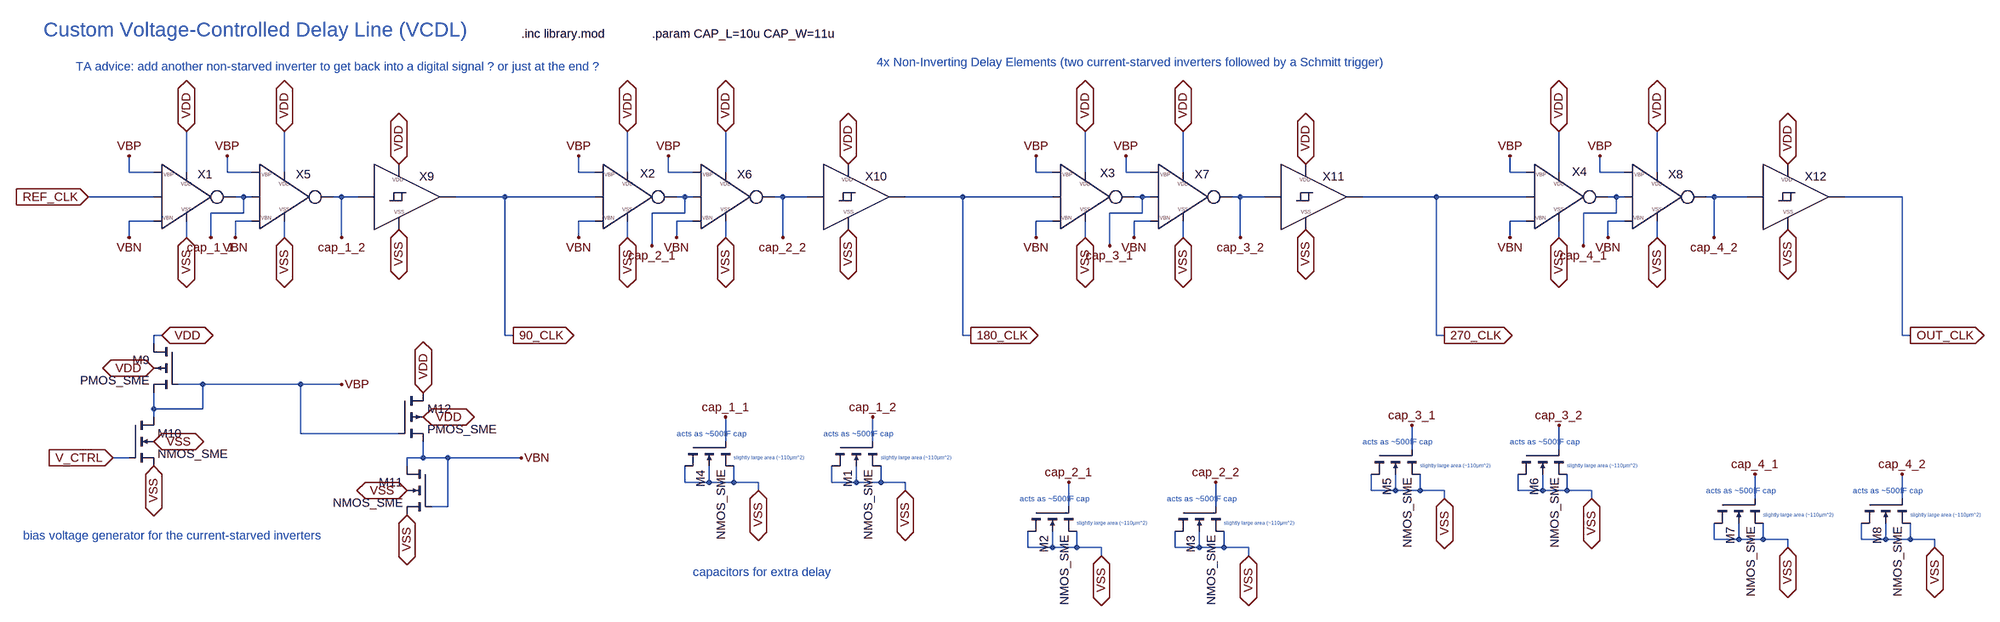
[diagram p0: schematic my_vcdl.asc]
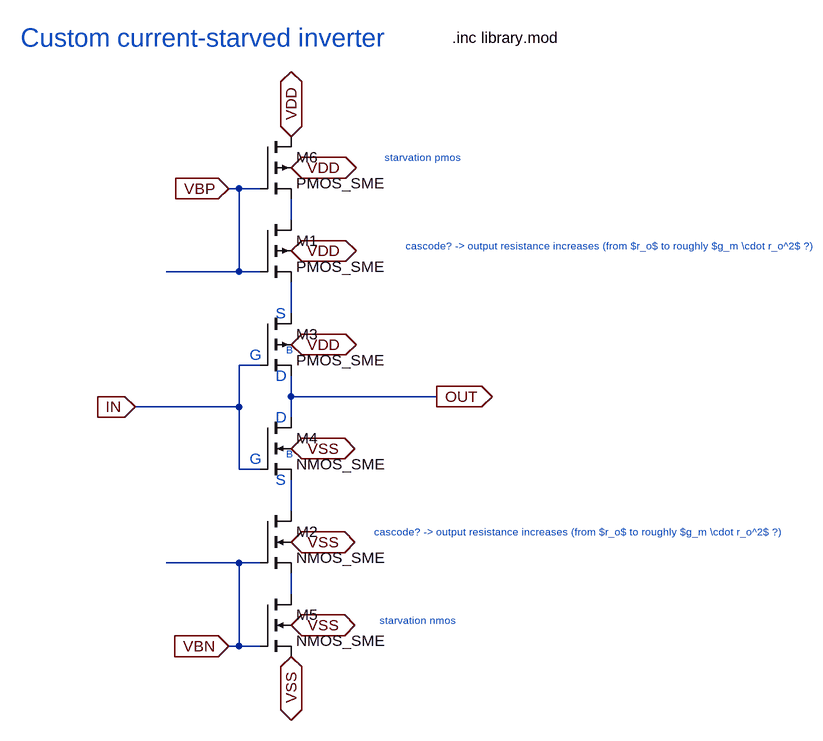
[diagram p1: sub-circuit my_current_starved_inverter.asc]
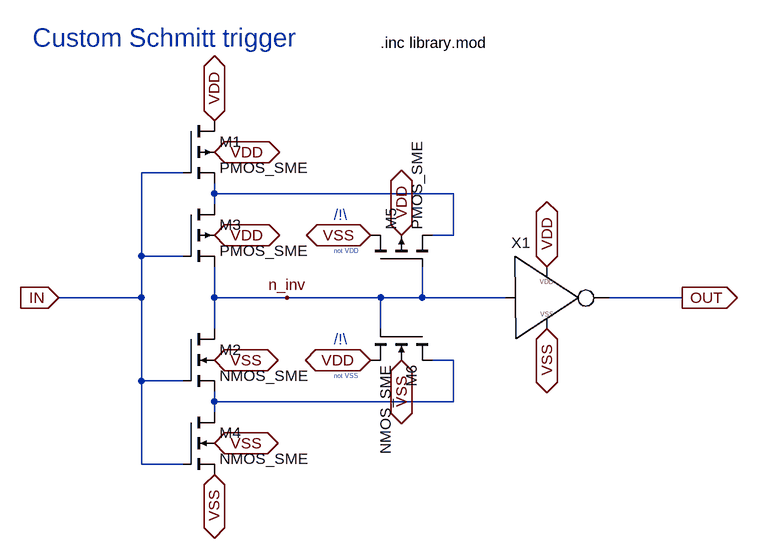
[diagram p2: sub-circuit my_schmitt_trigger.asc]
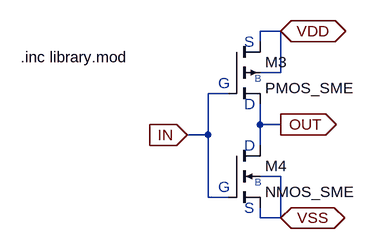
[diagram p3: sub-circuit my_inverter.asc]
my_vcdl.asc, the LTspice schematic file:
Version 4.1
SHEET 1 3608 1576
WIRE -48 160 -48 128
WIRE 0 160 -48 160
WIRE 64 160 64 80
WIRE 144 160 144 128
WIRE 192 160 144 160
WIRE 256 160 256 80
WIRE 832 160 832 128
WIRE 864 160 832 160
WIRE 928 160 928 80
WIRE 1008 160 1008 128
WIRE 1056 160 1008 160
WIRE 1120 160 1120 80
WIRE 1728 160 1728 128
WIRE 1760 160 1728 160
WIRE 1824 160 1824 80
WIRE 1904 160 1904 128
WIRE 1952 160 1904 160
WIRE 2016 160 2016 80
WIRE 2656 160 2656 128
WIRE 2688 160 2656 160
WIRE 2752 160 2752 80
WIRE 2832 160 2832 128
WIRE 2880 160 2832 160
WIRE 2944 160 2944 80
WIRE 0 208 -128 208
WIRE 176 208 160 208
WIRE 192 208 176 208
WIRE 368 208 352 208
WIRE 400 208 368 208
WIRE 688 208 592 208
WIRE 864 208 688 208
WIRE 1040 208 1024 208
WIRE 1056 208 1040 208
WIRE 1232 208 1216 208
WIRE 1280 208 1232 208
WIRE 1584 208 1472 208
WIRE 1760 208 1584 208
WIRE 1936 208 1920 208
WIRE 1952 208 1936 208
WIRE 2128 208 2112 208
WIRE 2176 208 2128 208
WIRE 2512 208 2368 208
WIRE 2688 208 2512 208
WIRE 2864 208 2848 208
WIRE 2880 208 2864 208
WIRE 3056 208 3040 208
WIRE 3120 208 3056 208
WIRE 3424 208 3312 208
WIRE 176 240 176 208
WIRE 176 240 112 240
WIRE 1040 240 1040 208
WIRE 1040 240 976 240
WIRE 1936 240 1936 208
WIRE 1936 240 1872 240
WIRE 2864 240 2864 208
WIRE 2864 240 2800 240
WIRE 0 256 -48 256
WIRE 192 256 160 256
WIRE 864 256 832 256
WIRE 1056 256 1024 256
WIRE 1760 256 1728 256
WIRE 1952 256 1920 256
WIRE 2688 256 2656 256
WIRE 2880 256 2848 256
WIRE -48 288 -48 256
WIRE 64 288 64 256
WIRE 112 288 112 240
WIRE 160 288 160 256
WIRE 256 288 256 256
WIRE 368 288 368 208
WIRE 832 288 832 256
WIRE 928 288 928 256
WIRE 1024 288 1024 256
WIRE 1120 288 1120 256
WIRE 1232 288 1232 208
WIRE 1728 288 1728 256
WIRE 1824 288 1824 256
WIRE 1920 288 1920 256
WIRE 2016 288 2016 256
WIRE 2128 288 2128 208
WIRE 2656 288 2656 256
WIRE 2752 288 2752 256
WIRE 2848 288 2848 256
WIRE 2944 288 2944 256
WIRE 3056 288 3056 208
WIRE 976 304 976 240
WIRE 1872 304 1872 240
WIRE 2800 304 2800 240
WIRE 16 480 0 480
WIRE 688 480 688 208
WIRE 704 480 688 480
WIRE 1584 480 1584 208
WIRE 1600 480 1584 480
WIRE 2512 480 2512 208
WIRE 2528 480 2512 480
WIRE 3424 480 3424 208
WIRE 3440 480 3424 480
WIRE 0 496 0 480
WIRE 96 576 48 576
WIRE 288 576 96 576
WIRE 368 576 288 576
WIRE 0 624 0 592
WIRE 96 624 96 576
WIRE 96 624 0 624
WIRE 0 640 0 624
WIRE 288 672 288 576
WIRE 480 672 288 672
WIRE 1120 688 1120 640
WIRE 1408 688 1408 640
WIRE 2464 704 2464 656
WIRE 2752 704 2752 656
WIRE -48 720 -80 720
WIRE 528 720 528 688
WIRE 528 720 496 720
WIRE 576 720 528 720
WIRE 720 720 576 720
WIRE 496 736 496 720
WIRE 1040 768 1040 736
WIRE 1088 768 1088 736
WIRE 1088 768 1040 768
WIRE 1136 768 1136 736
WIRE 1136 768 1088 768
WIRE 1184 768 1136 768
WIRE 1328 768 1328 736
WIRE 1376 768 1376 736
WIRE 1376 768 1328 768
WIRE 1424 768 1424 736
WIRE 1424 768 1376 768
WIRE 1472 768 1424 768
WIRE 1184 784 1184 768
WIRE 1472 784 1472 768
WIRE 2384 784 2384 752
WIRE 2432 784 2432 752
WIRE 2432 784 2384 784
WIRE 2480 784 2480 752
WIRE 2480 784 2432 784
WIRE 2528 784 2480 784
WIRE 2672 784 2672 752
WIRE 2720 784 2720 752
WIRE 2720 784 2672 784
WIRE 2768 784 2768 752
WIRE 2768 784 2720 784
WIRE 2816 784 2768 784
WIRE 2528 800 2528 784
WIRE 2816 800 2816 784
WIRE 3136 800 3136 752
WIRE 3424 800 3424 752
WIRE 576 816 576 720
WIRE 576 816 544 816
WIRE 1792 816 1792 768
WIRE 2080 816 2080 768
WIRE 3056 880 3056 848
WIRE 3104 880 3104 848
WIRE 3104 880 3056 880
WIRE 3152 880 3152 848
WIRE 3152 880 3104 880
WIRE 3200 880 3152 880
WIRE 3344 880 3344 848
WIRE 3392 880 3392 848
WIRE 3392 880 3344 880
WIRE 3440 880 3440 848
WIRE 3440 880 3392 880
WIRE 3488 880 3440 880
WIRE 1712 896 1712 864
WIRE 1760 896 1760 864
WIRE 1760 896 1712 896
WIRE 1808 896 1808 864
WIRE 1808 896 1760 896
WIRE 1856 896 1808 896
WIRE 2000 896 2000 864
WIRE 2048 896 2048 864
WIRE 2048 896 2000 896
WIRE 2096 896 2096 864
WIRE 2096 896 2048 896
WIRE 2144 896 2096 896
WIRE 3200 896 3200 880
WIRE 3488 896 3488 880
WIRE 1856 912 1856 896
WIRE 2144 912 2144 896
FLAG -128 208 REF_CLK
IOPIN -128 208 In
FLAG -80 720 V_CTRL
IOPIN -80 720 In
FLAG 3440 480 OUT_CLK
IOPIN 3440 480 Out
FLAG 1600 480 180_CLK
IOPIN 1600 480 Out
FLAG 704 480 90_CLK
IOPIN 704 480 Out
FLAG 2528 480 270_CLK
IOPIN 2528 480 Out
FLAG 16 480 VDD
IOPIN 16 480 BiDir
FLAG 0 736 VSS
IOPIN 0 736 BiDir
FLAG 0 688 VSS
IOPIN 0 688 BiDir
FLAG 0 544 VDD
IOPIN 0 544 BiDir
FLAG 64 288 VSS
IOPIN 64 288 BiDir
FLAG 928 288 VSS
IOPIN 928 288 BiDir
FLAG 1824 288 VSS
IOPIN 1824 288 BiDir
FLAG 2752 288 VSS
IOPIN 2752 288 BiDir
FLAG 2752 80 VDD
IOPIN 2752 80 BiDir
FLAG 1824 80 VDD
IOPIN 1824 80 BiDir
FLAG 928 80 VDD
IOPIN 928 80 BiDir
FLAG 64 80 VDD
IOPIN 64 80 BiDir
FLAG 256 288 VSS
IOPIN 256 288 BiDir
FLAG 1120 288 VSS
IOPIN 1120 288 BiDir
FLAG 2016 288 VSS
IOPIN 2016 288 BiDir
FLAG 2944 288 VSS
IOPIN 2944 288 BiDir
FLAG 2944 80 VDD
IOPIN 2944 80 BiDir
FLAG 2016 80 VDD
IOPIN 2016 80 BiDir
FLAG 1120 80 VDD
IOPIN 1120 80 BiDir
FLAG 256 80 VDD
IOPIN 256 80 BiDir
FLAG 368 576 VBP
FLAG 720 720 VBN
FLAG 1008 128 VBP
FLAG 1024 288 VBN
FLAG 832 128 VBP
FLAG 144 128 VBP
FLAG -48 128 VBP
FLAG 1728 128 VBP
FLAG 1904 128 VBP
FLAG 2656 128 VBP
FLAG 2832 128 VBP
FLAG 1728 288 VBN
FLAG 1920 288 VBN
FLAG 2656 288 VBN
FLAG 2848 288 VBN
FLAG 832 288 VBN
FLAG 160 288 VBN
FLAG -48 288 VBN
FLAG 480 144 VDD
IOPIN 480 144 BiDir
FLAG 480 272 VSS
IOPIN 480 272 BiDir
FLAG 1360 144 VDD
IOPIN 1360 144 BiDir
FLAG 1360 272 VSS
IOPIN 1360 272 BiDir
FLAG 2256 144 VDD
IOPIN 2256 144 BiDir
FLAG 2256 272 VSS
IOPIN 2256 272 BiDir
FLAG 3200 144 VDD
IOPIN 3200 144 BiDir
FLAG 3200 272 VSS
IOPIN 3200 272 BiDir
FLAG 496 784 VSS
IOPIN 496 784 BiDir
FLAG 528 640 VDD
IOPIN 528 640 BiDir
FLAG 528 592 VDD
IOPIN 528 592 BiDir
FLAG 496 832 VSS
IOPIN 496 832 BiDir
FLAG 1184 784 VSS
IOPIN 1184 784 BiDir
FLAG 1120 640 cap_1_1
FLAG 1472 784 VSS
IOPIN 1472 784 BiDir
FLAG 1408 640 cap_1_2
FLAG 1856 912 VSS
IOPIN 1856 912 BiDir
FLAG 1792 768 cap_2_1
FLAG 2144 912 VSS
IOPIN 2144 912 BiDir
FLAG 2080 768 cap_2_2
FLAG 2528 800 VSS
IOPIN 2528 800 BiDir
FLAG 2464 656 cap_3_1
FLAG 2816 800 VSS
IOPIN 2816 800 BiDir
FLAG 2752 656 cap_3_2
FLAG 3200 896 VSS
IOPIN 3200 896 BiDir
FLAG 3136 752 cap_4_1
FLAG 3488 896 VSS
IOPIN 3488 896 BiDir
FLAG 3424 752 cap_4_2
FLAG 112 288 cap_1_1
FLAG 368 288 cap_1_2
FLAG 976 304 cap_2_1
FLAG 1232 288 cap_2_2
FLAG 1872 304 cap_3_1
FLAG 2128 288 cap_3_2
FLAG 2800 304 cap_4_1
FLAG 3056 288 cap_4_2
SYMBOL pmos4 48 496 M0
SYMATTR InstName M9
SYMATTR Value PMOS_SME
SYMATTR Value2 l=2u w=2u
SYMBOL nmos4 -48 640 R0
SYMATTR InstName M10
SYMATTR Value NMOS_SME
SYMATTR Value2 l=2u w=0.4u
SYMBOL my_current_starved_inverter 64 208 R0
WINDOW 0 37 -28 Bottom 2
SYMATTR InstName X1
SYMBOL my_current_starved_inverter 928 208 R0
WINDOW 0 39 -30 Bottom 2
SYMATTR InstName X2
SYMBOL my_current_starved_inverter 1824 208 R0
WINDOW 0 44 -31 Bottom 2
SYMATTR InstName X3
SYMBOL my_current_starved_inverter 2752 208 R0
WINDOW 0 40 -33 Bottom 2
SYMATTR InstName X4
SYMBOL my_current_starved_inverter 256 208 R0
WINDOW 0 37 -28 Bottom 2
SYMATTR InstName X5
SYMBOL my_current_starved_inverter 1120 208 R0
WINDOW 0 37 -28 Bottom 2
SYMATTR InstName X6
SYMBOL my_current_starved_inverter 2016 208 R0
WINDOW 0 37 -28 Bottom 2
SYMATTR InstName X7
SYMBOL my_current_starved_inverter 2944 208 R0
WINDOW 0 37 -28 Bottom 2
SYMATTR InstName X8
SYMBOL my_schmitt_trigger 480 208 R0
SYMATTR InstName X9
SYMBOL my_schmitt_trigger 1360 208 R0
SYMATTR InstName X10
SYMBOL my_schmitt_trigger 2256 208 R0
SYMATTR InstName X11
SYMBOL my_schmitt_trigger 3200 208 R0
SYMATTR InstName X12
SYMBOL nmos4 544 736 M0
SYMATTR InstName M11
SYMATTR Value NMOS_SME
SYMATTR Value2 l=2u w=0.4u
SYMBOL pmos4 480 592 R0
SYMATTR InstName M12
SYMATTR Value PMOS_SME
SYMATTR Value2 l=2u w=2u
SYMBOL nmos4 1040 688 M90
SYMATTR InstName M4
SYMATTR Value NMOS_SME
SYMATTR Value2 l={CAP_L} w={CAP_W}
SYMBOL nmos4 1328 688 M90
SYMATTR InstName M1
SYMATTR Value NMOS_SME
SYMATTR Value2 l={CAP_L} w={CAP_W}
SYMBOL nmos4 1712 816 M90
SYMATTR InstName M2
SYMATTR Value NMOS_SME
SYMATTR Value2 l={CAP_L} w={CAP_W}
SYMBOL nmos4 2000 816 M90
SYMATTR InstName M3
SYMATTR Value NMOS_SME
SYMATTR Value2 l={CAP_L} w={CAP_W}
SYMBOL nmos4 2384 704 M90
SYMATTR InstName M5
SYMATTR Value NMOS_SME
SYMATTR Value2 l={CAP_L} w={CAP_W}
SYMBOL nmos4 2672 704 M90
SYMATTR InstName M6
SYMATTR Value NMOS_SME
SYMATTR Value2 l={CAP_L} w={CAP_W}
SYMBOL nmos4 3056 800 M90
SYMATTR InstName M7
SYMATTR Value NMOS_SME
SYMATTR Value2 l={CAP_L} w={CAP_W}
SYMBOL nmos4 3344 800 M90
SYMATTR InstName M8
SYMATTR Value NMOS_SME
SYMATTR Value2 l={CAP_L} w={CAP_W}
TEXT -216 -120 Left 4 ;Custom Voltage-Controlled Delay Line (VCDL)
TEXT 720 -112 Left 2 !.inc library.mod
TEXT -152 -48 Left 2 ;TA advice: add another non-starved inverter to get back into a digital signal ? or just at the end ?
TEXT 1416 -56 Left 2 ;4x Non-Inverting Delay Elements (two current-starved inverters followed by a Schmitt trigger)
TEXT -256 872 Left 2 ;bias voltage generator for the current-starved inverters
TEXT 1136 720 Left 0 ;slightly large area (~110μm^2)
TEXT 1024 672 Left 1 ;acts as ~500fF cap
TEXT 1424 720 Left 0 ;slightly large area (~110μm^2)
TEXT 1312 672 Left 1 ;acts as ~500fF cap
TEXT 1808 848 Left 0 ;slightly large area (~110μm^2)
TEXT 1696 800 Left 1 ;acts as ~500fF cap
TEXT 2096 848 Left 0 ;slightly large area (~110μm^2)
TEXT 1984 800 Left 1 ;acts as ~500fF cap
TEXT 2480 736 Left 0 ;slightly large area (~110μm^2)
TEXT 2368 688 Left 1 ;acts as ~500fF cap
TEXT 2768 736 Left 0 ;slightly large area (~110μm^2)
TEXT 2656 688 Left 1 ;acts as ~500fF cap
TEXT 3152 832 Left 0 ;slightly large area (~110μm^2)
TEXT 3040 784 Left 1 ;acts as ~500fF cap
TEXT 3440 832 Left 0 ;slightly large area (~110μm^2)
TEXT 3328 784 Left 1 ;acts as ~500fF cap
TEXT 976 -112 Left 2 !.param CAP_L=10u CAP_W=11u
TEXT 1056 944 Left 2 ;capacitors for extra delay

my_current_starved_inverter.asc, the sub-circuit schematic file:
Version 4.1
SHEET 1 1424 920
WIRE 496 80 480 80
WIRE 528 80 496 80
WIRE 576 128 576 96
WIRE 496 208 496 80
WIRE 496 208 384 208
WIRE 528 208 496 208
WIRE 576 272 576 224
WIRE 528 352 496 352
WIRE 576 400 576 368
WIRE 800 400 576 400
WIRE 496 416 496 352
WIRE 496 416 336 416
WIRE 576 432 576 400
WIRE 496 512 496 416
WIRE 528 512 496 512
WIRE 576 576 576 528
WIRE 496 656 384 656
WIRE 528 656 496 656
WIRE 576 704 576 672
WIRE 496 784 496 656
WIRE 496 784 480 784
WIRE 528 784 496 784
FLAG 576 320 VDD
IOPIN 576 320 BiDir
FLAG 576 480 VSS
IOPIN 576 480 BiDir
FLAG 800 400 OUT
IOPIN 800 400 Out
FLAG 336 416 IN
IOPIN 336 416 In
FLAG 576 624 VSS
IOPIN 576 624 BiDir
FLAG 576 176 VDD
IOPIN 576 176 BiDir
FLAG 576 0 VDD
IOPIN 576 0 BiDir
FLAG 576 800 VSS
IOPIN 576 800 BiDir
FLAG 480 80 VBP
IOPIN 480 80 In
FLAG 480 784 VBN
IOPIN 480 784 In
FLAG 576 752 VSS
IOPIN 576 752 BiDir
FLAG 576 48 VDD
IOPIN 576 48 BiDir
SYMBOL pmos4 528 272 R0
SYMATTR InstName M3
SYMATTR Value PMOS_SME
SYMATTR Value2 l=0.35u w=1.2u
SYMBOL nmos4 528 432 R0
SYMATTR InstName M4
SYMATTR Value NMOS_SME
SYMATTR Value2 l=0.35u w=0.4u
SYMBOL pmos4 528 128 R0
SYMATTR InstName M1
SYMATTR Value PMOS_SME
SYMATTR Value2 l=2u w=2.35u
SYMBOL nmos4 528 576 R0
SYMATTR InstName M2
SYMATTR Value NMOS_SME
SYMATTR Value2 l=2u w=0.4u
SYMBOL nmos4 528 704 R0
SYMATTR InstName M5
SYMATTR Value NMOS_SME
SYMATTR Value2 l=2u w=0.4u
SYMBOL pmos4 528 0 R0
SYMATTR InstName M6
SYMATTR Value PMOS_SME
SYMATTR Value2 l=2u w=2.35u
TEXT 552 272 Left 2 ;S
TEXT 552 528 Left 2 ;S
TEXT 552 368 Left 2 ;D
TEXT 552 432 Left 2 ;D
TEXT 512 336 Left 2 ;G
TEXT 512 496 Left 2 ;G
TEXT 568 328 Left 1 ;B
TEXT 568 488 Left 1 ;B
TEXT 824 -152 Left 2 !.inc library.mod
TEXT 160 -152 Left 4 ;Custom current-starved inverter
TEXT 704 608 Left 1 ;cascode? -> output resistance increases (from $r_o$ to roughly $g_m \\cdot r_o^2$ ?)
TEXT 752 168 Left 1 ;cascode? -> output resistance increases (from $r_o$ to roughly $g_m \\cdot r_o^2$ ?)
TEXT 720 32 Left 1 ;starvation pmos
TEXT 712 744 Left 1 ;starvation nmos

my_schmitt_trigger.asc, the sub-circuit schematic file:
Version 4.1
SHEET 1 1300 892
WIRE 160 256 96 256
WIRE 208 288 208 272
WIRE 576 288 208 288
WIRE 208 304 208 288
WIRE 576 352 576 288
WIRE 576 352 544 352
WIRE 96 384 96 256
WIRE 160 384 96 384
WIRE 96 448 96 384
WIRE 96 448 -32 448
WIRE 208 448 208 400
WIRE 320 448 208 448
WIRE 464 448 320 448
WIRE 528 448 528 400
WIRE 528 448 464 448
WIRE 656 448 528 448
WIRE 928 448 816 448
WIRE 208 496 208 448
WIRE 464 496 464 448
WIRE 576 544 544 544
WIRE 96 576 96 448
WIRE 160 576 96 576
WIRE 208 608 208 592
WIRE 576 608 576 544
WIRE 576 608 208 608
WIRE 208 624 208 608
WIRE 96 704 96 576
WIRE 160 704 96 704
FLAG -32 448 IN
IOPIN -32 448 In
FLAG 928 448 OUT
IOPIN 928 448 Out
FLAG 208 176 VDD
IOPIN 208 176 BiDir
FLAG 208 224 VDD
IOPIN 208 224 BiDir
FLAG 208 352 VDD
IOPIN 208 352 BiDir
FLAG 208 720 VSS
IOPIN 208 720 BiDir
FLAG 448 352 VSS
IOPIN 448 352 BiDir
FLAG 496 352 VDD
IOPIN 496 352 BiDir
FLAG 496 544 VSS
IOPIN 496 544 BiDir
FLAG 208 544 VSS
IOPIN 208 544 BiDir
FLAG 208 672 VSS
IOPIN 208 672 BiDir
FLAG 448 544 VDD
IOPIN 448 544 BiDir
FLAG 320 448 n_inv
FLAG 720 400 VDD
IOPIN 720 400 BiDir
FLAG 720 496 VSS
IOPIN 720 496 BiDir
SYMBOL pmos4 160 176 R0
SYMATTR InstName M1
SYMATTR Value PMOS_SME
SYMATTR Value2 l=0.35u w=2u
SYMBOL nmos4 160 496 R0
SYMATTR InstName M2
SYMATTR Value NMOS_SME
SYMATTR Value2 l=0.35u w=1u
SYMBOL pmos4 160 304 R0
SYMATTR InstName M3
SYMATTR Value PMOS_SME
SYMATTR Value2 l=0.35u w=2u
SYMBOL nmos4 160 624 R0
SYMATTR InstName M4
SYMATTR Value NMOS_SME
SYMATTR Value2 l=0.35u w=1u
SYMBOL pmos4 448 400 R270
SYMATTR InstName M5
SYMATTR Value PMOS_SME
SYMATTR Value2 l=0.35u w=0.8u
SYMBOL nmos4 544 496 R90
SYMATTR InstName M6
SYMATTR Value NMOS_SME
SYMATTR Value2 l=0.35u w=0.4u
SYMBOL my_inverter 720 448 R0
WINDOW 0 -40 -69 Bottom 2
SYMATTR InstName X1
TEXT -72 48 Left 4 ;Custom Schmitt trigger
TEXT 464 56 Left 2 !.inc library.mod
TEXT 392 320 Left 2 ;/!\\
TEXT 392 512 Left 2 ;/!\\
TEXT 392 376 Left 0 ;not VDD
TEXT 392 568 Left 0 ;not VSS

my_inverter.asc, the sub-circuit schematic file:
Version 4.1
SHEET 1 880 680
WIRE 608 -32 576 -32
WIRE 576 -16 576 -32
WIRE 608 32 608 -32
WIRE 608 32 576 32
WIRE 528 64 496 64
WIRE 576 112 576 80
WIRE 608 112 576 112
WIRE 496 128 496 64
WIRE 496 128 464 128
WIRE 576 144 576 112
WIRE 608 192 576 192
WIRE 496 224 496 128
WIRE 528 224 496 224
WIRE 576 256 576 240
WIRE 608 256 608 192
WIRE 608 256 576 256
FLAG 608 -32 VDD
IOPIN 608 -32 BiDir
FLAG 608 256 VSS
IOPIN 608 256 BiDir
FLAG 608 112 OUT
IOPIN 608 112 Out
FLAG 464 128 IN
IOPIN 464 128 In
SYMBOL pmos4 528 -16 R0
SYMATTR InstName M3
SYMATTR Value PMOS_SME
SYMATTR Value2 l=0.35u w=0.4u
SYMBOL nmos4 528 144 R0
SYMATTR InstName M4
SYMATTR Value NMOS_SME
SYMATTR Value2 l=0.35u w=0.4u
TEXT 552 -16 Left 2 ;S
TEXT 552 240 Left 2 ;S
TEXT 552 80 Left 2 ;D
TEXT 552 144 Left 2 ;D
TEXT 512 48 Left 2 ;G
TEXT 512 208 Left 2 ;G
TEXT 568 40 Left 1 ;B
TEXT 568 200 Left 1 ;B
TEXT 208 8 Left 2 !.inc library.mod

The netlist it stands for:
* my_vcdl.asc
M9 VDD VBP VBP VDD PMOS_SME l=2u w=2u
M10 VBP V_CTRL VSS VSS NMOS_SME l=2u w=0.4u
X§X1 REF_CLK cap_1_1 VDD VSS VBP VBN my_current_starved_inverter
X§X2 90_CLK cap_2_1 VDD VSS VBP VBN my_current_starved_inverter
X§X3 180_CLK cap_3_1 VDD VSS VBP VBN my_current_starved_inverter
X§X4 270_CLK cap_4_1 VDD VSS VBP VBN my_current_starved_inverter
X§X5 cap_1_1 cap_1_2 VDD VSS VBP VBN my_current_starved_inverter
X§X6 cap_2_1 cap_2_2 VDD VSS VBP VBN my_current_starved_inverter
X§X7 cap_3_1 cap_3_2 VDD VSS VBP VBN my_current_starved_inverter
X§X8 cap_4_1 cap_4_2 VDD VSS VBP VBN my_current_starved_inverter
X§X9 cap_1_2 90_CLK VDD VSS my_schmitt_trigger
X§X10 cap_2_2 180_CLK VDD VSS my_schmitt_trigger
X§X11 cap_3_2 270_CLK VDD VSS my_schmitt_trigger
X§X12 cap_4_2 OUT_CLK VDD VSS my_schmitt_trigger
M11 VBN VBN VSS VSS NMOS_SME l=2u w=0.4u
M12 VDD VBP VBN VDD PMOS_SME l=2u w=2u
M4 VSS cap_1_1 VSS VSS NMOS_SME l={CAP_L} w={CAP_W}
M1 VSS cap_1_2 VSS VSS NMOS_SME l={CAP_L} w={CAP_W}
M2 VSS cap_2_1 VSS VSS NMOS_SME l={CAP_L} w={CAP_W}
M3 VSS cap_2_2 VSS VSS NMOS_SME l={CAP_L} w={CAP_W}
M5 VSS cap_3_1 VSS VSS NMOS_SME l={CAP_L} w={CAP_W}
M6 VSS cap_3_2 VSS VSS NMOS_SME l={CAP_L} w={CAP_W}
M7 VSS cap_4_1 VSS VSS NMOS_SME l={CAP_L} w={CAP_W}
M8 VSS cap_4_2 VSS VSS NMOS_SME l={CAP_L} w={CAP_W}

* block symbol definitions
.subckt my_current_starved_inverter IN OUT VDD VSS VBP VBN
M3 N002 IN OUT VDD PMOS_SME l=0.35u w=1.2u
M4 OUT IN N003 VSS NMOS_SME l=0.35u w=0.4u
M1 N001 VBP N002 VDD PMOS_SME l=2u w=2.35u
M2 N003 VBN N004 VSS NMOS_SME l=2u w=0.4u
M5 N004 VBN VSS VSS NMOS_SME l=2u w=0.4u
M6 VDD VBP N001 VDD PMOS_SME l=2u w=2.35u
* S
* S
* D
* D
* G
* G
* B
* B
.inc library.mod
* Custom current-starved inverter
* cascode? -> output resistance increases (from $r_o$ to roughly $g_m \cdot r_o^2$ ?)
* cascode? -> output resistance increases (from $r_o$ to roughly $g_m \cdot r_o^2$ ?)
* starvation pmos
* starvation nmos
.ends my_current_starved_inverter

.subckt my_schmitt_trigger IN OUT VDD VSS
M1 VDD IN N001 VDD PMOS_SME l=0.35u w=2u
M2 n_inv IN N002 VSS NMOS_SME l=0.35u w=1u
M3 N001 IN n_inv VDD PMOS_SME l=0.35u w=2u
M4 N002 IN VSS VSS NMOS_SME l=0.35u w=1u
M5 VSS n_inv N001 VDD PMOS_SME l=0.35u w=0.8u
M6 N002 n_inv VDD VSS NMOS_SME l=0.35u w=0.4u
X§X1 n_inv OUT VDD VSS my_inverter
* Custom Schmitt trigger
.inc library.mod
* /!\
* /!\
* not VDD
* not VSS
.ends my_schmitt_trigger

.subckt my_inverter IN OUT VDD VSS
M3 VDD IN OUT VDD PMOS_SME l=0.35u w=0.4u
M4 OUT IN VSS VSS NMOS_SME l=0.35u w=0.4u
* S
* S
* D
* D
* G
* G
* B
* B
.inc library.mod
.ends my_inverter

.model NMOS NMOS
.model PMOS PMOS
.lib standard.mos
* Custom Voltage-Controlled Delay Line (VCDL)
.inc library.mod
* TA advice: add another non-starved inverter to get back into a digital signal ? or just at the end ?
* 4x Non-Inverting Delay Elements (two current-starved inverters followed by a Schmitt trigger)
* bias voltage generator for the current-starved inverters
* slightly large area (~110μm^2)
* acts as ~500fF cap
* slightly large area (~110μm^2)
* acts as ~500fF cap
* slightly large area (~110μm^2)
* acts as ~500fF cap
* slightly large area (~110μm^2)
* acts as ~500fF cap
* slightly large area (~110μm^2)
* acts as ~500fF cap
* slightly large area (~110μm^2)
* acts as ~500fF cap
* slightly large area (~110μm^2)
* acts as ~500fF cap
* slightly large area (~110μm^2)
* acts as ~500fF cap
.param CAP_L=10u CAP_W=11u
* capacitors for extra delay
.backanno
.end